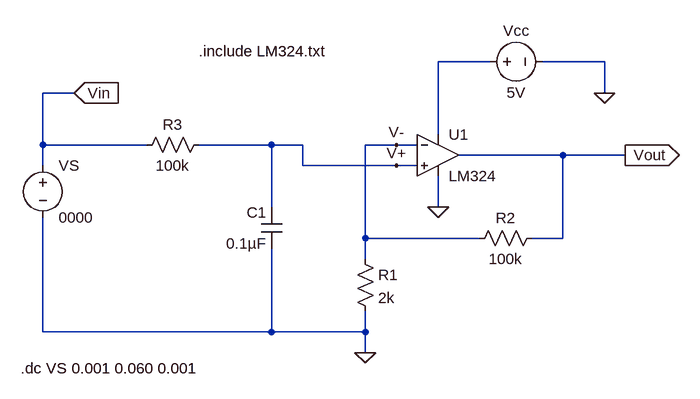
[diagram p0: schematic Irradiance_Amplifier_Circuit.asc]
Irradiance_Amplifier_Circuit.asc, the LTspice schematic file:
Version 4
SHEET 1 880 680
WIRE 416 -16 336 -16
WIRE 592 -16 496 -16
WIRE -224 32 -272 32
WIRE 592 32 592 -16
WIRE 336 96 336 -16
WIRE -272 112 -272 32
WIRE -112 112 -272 112
WIRE 80 112 -32 112
WIRE 128 112 80 112
WIRE 272 112 224 112
WIRE 304 112 272 112
WIRE 528 128 368 128
WIRE 624 128 528 128
WIRE -272 144 -272 112
WIRE 128 144 128 112
WIRE 272 144 128 144
WIRE 304 144 272 144
WIRE 80 208 80 112
WIRE 336 208 336 160
WIRE 224 256 224 112
WIRE 400 256 224 256
WIRE 528 256 528 128
WIRE 528 256 480 256
WIRE 224 288 224 256
WIRE -272 400 -272 224
WIRE 80 400 80 272
WIRE 80 400 -272 400
WIRE 224 400 224 368
WIRE 224 400 80 400
WIRE 224 432 224 400
FLAG 336 208 0
FLAG 624 128 Vout
IOPIN 624 128 Out
FLAG 224 432 0
FLAG -224 32 Vin
IOPIN -224 32 In
FLAG 592 32 0
FLAG 272 144 V+
FLAG 272 112 V-
SYMBOL Opamps\\opamp2 336 64 R0
SYMATTR InstName U1
SYMATTR Value LM324
SYMBOL res 208 272 R0
SYMATTR InstName R1
SYMATTR Value 2k
SYMBOL res 496 240 R90
WINDOW 0 0 56 VBottom 2
WINDOW 3 32 56 VTop 2
SYMATTR InstName R2
SYMATTR Value 100k
SYMBOL res -128 128 R270
WINDOW 0 32 56 VTop 2
WINDOW 3 0 56 VBottom 2
SYMATTR InstName R3
SYMATTR Value 100k
SYMBOL cap 96 272 R180
WINDOW 0 24 56 Left 2
WINDOW 3 24 8 Left 2
SYMATTR InstName C1
SYMATTR Value 0.1µF
SYMBOL voltage -272 128 R0
WINDOW 123 0 0 Left 2
WINDOW 39 0 0 Left 2
SYMATTR InstName VS
SYMATTR Value 0000
SYMBOL voltage 400 -16 R270
WINDOW 0 32 56 VTop 2
WINDOW 3 -32 56 VBottom 2
SYMATTR InstName Vcc
SYMATTR Value 5V
TEXT -32 -32 Left 2 !.include LM324.txt
TEXT -306 456 Left 2 !.dc VS 0.001 0.060 0.001

The netlist it stands for:
* Irradiance_Amplifier_Circuit.asc
XU1 V+ V- N001 0 Vout LM324  ; pins In+ In- V+ V- OUT
R1 V- 0 2k
R2 Vout V- 100k
R3 Vin V+ 100k
C1 0 V+ 0.1µF
VS Vin 0 0000
Vcc N001 0 5V
.include LM324.txt
.dc VS 0.001 0.060 0.001
.backanno
.end

* Results of the author's LTspice run, read from the files saved beside the schematic
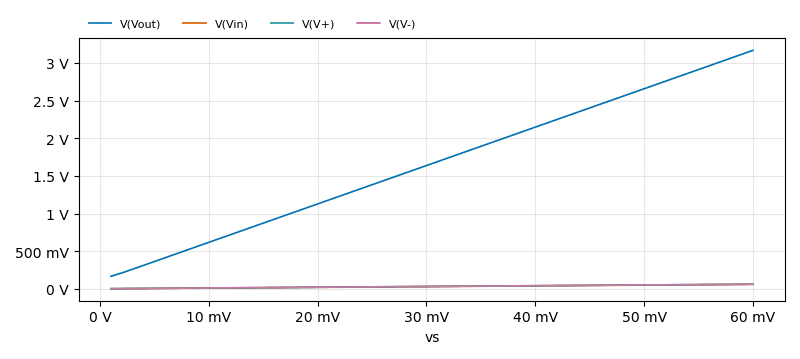
[diagram p1: DC transfer characteristic of Irradiance_Amplifier_Circuit.asc, plotted from the saved traces]
* DC transfer characteristic, 1 run:
*   V(Vout): 166.6 mV at vs=1 mV, 3.166 V at vs=60 mV, min 166.6 mV, max 3.166 V
*   V(Vin): 1 mV at vs=1 mV, 60 mV at vs=60 mV, min 1 mV, max 60 mV
*   V(V+): 3.026 mV at vs=1 mV, 62.02 mV at vs=60 mV, min 3.026 mV, max 62.02 mV
*   V(V-): 3.306 mV at vs=1 mV, 62.12 mV at vs=60 mV, min 3.306 mV, max 62.12 mV